# Altium project kmetria.PrjPcb
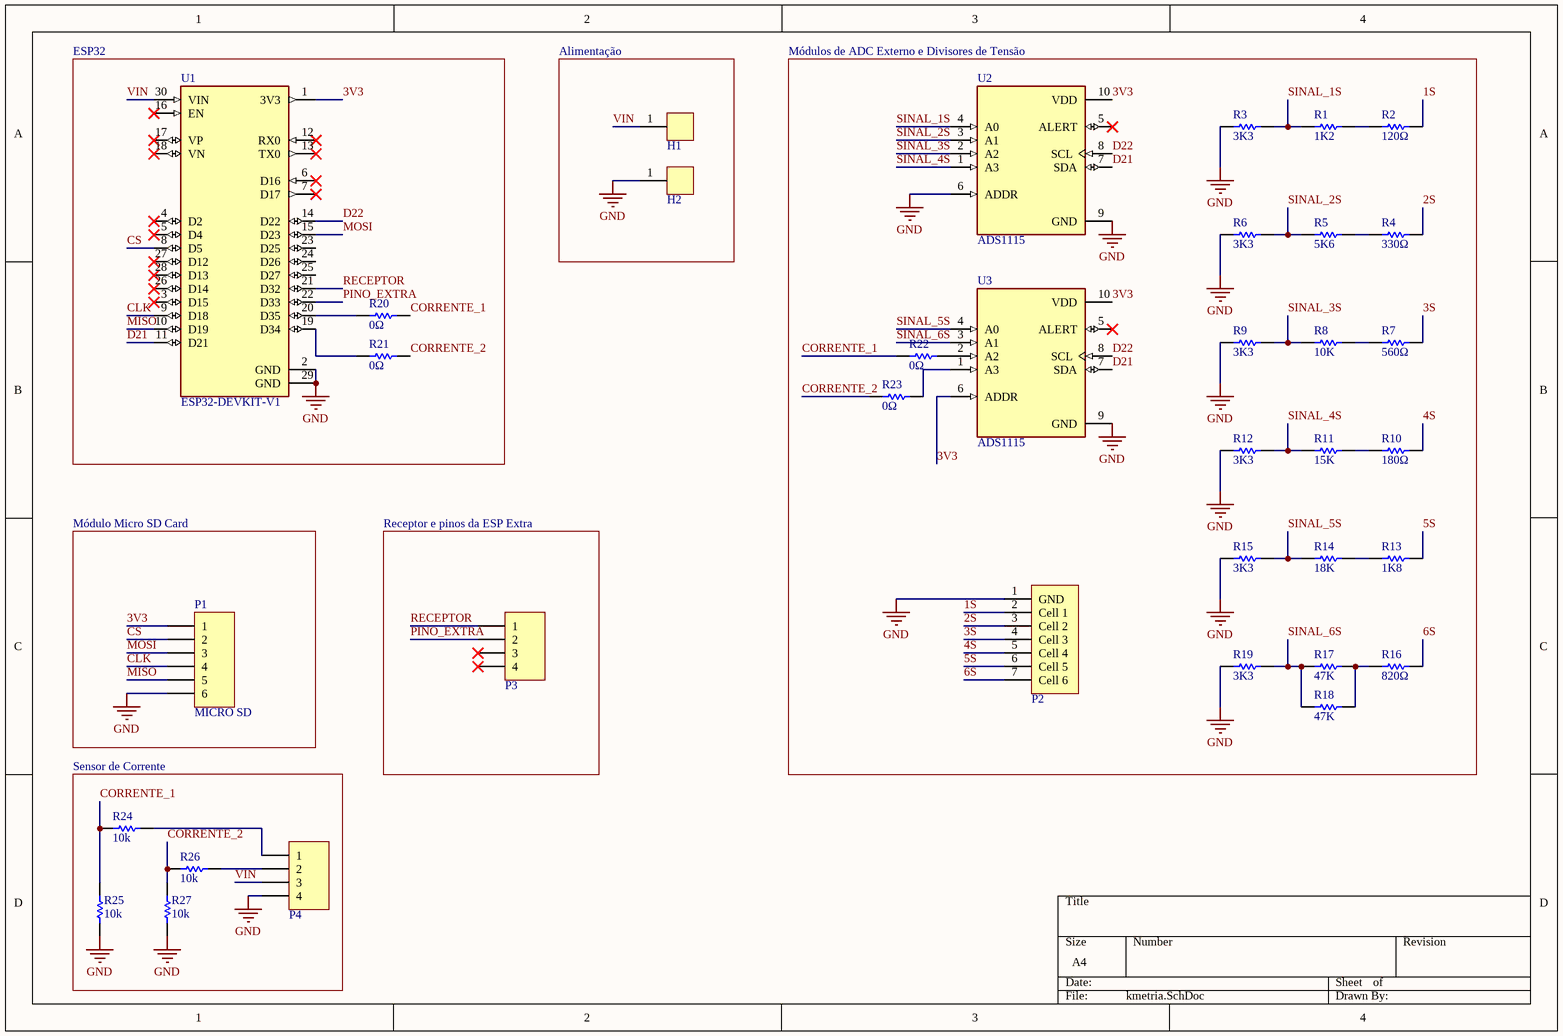
[diagram p0: kmetria.SchDoc]
1 sheet, 36 parts. Net scope: global (net labels, ports and power ports of the same name join across sheets).
Board file: kmetria.PcbDoc

## Sheet kmetria.SchDoc
size A4; SheetNumber: 1; SheetTotal: 1

### Parts
H1  Hole  [Hole 1x1]  (value not drawn)
H2  Hole  [Hole 1x1]  (value not drawn)
P1  MICRO SD  [HDR1X6]
P2  Header Male 1x7  [HDR MALE 1x7]  (value not drawn)
P3  Header 1x4  [HDR MALE 1x4]  (value not drawn)
P4  Header 1x4  [HDR MALE 1x4]  (value not drawn)
R1  1K2  [RESISTOR 0805]
R2  120Ω  [RESISTOR 0805]
R3  3K3  [RESISTOR 0805]
R4  330Ω  [RESISTOR 0805]
R5  5K6  [RESISTOR 0805]
R6  3K3  [RESISTOR 0805]
R7  560Ω  [RESISTOR 0805]
R8  10K  [RESISTOR 0805]
R9  3K3  [RESISTOR 0805]
R10  180Ω  [RESISTOR 0805]
R11  15K  [RESISTOR 0805]
R12  3K3  [RESISTOR 0805]
R13  1K8  [RESISTOR 0805]
R14  value 18K  [RESISTOR 0805]  (hidden comment: Resistor 1k +/-1% 1206 250 mW)
R15  3K3  [RESISTOR 0805]
R16  820Ω  [RESISTOR 0805]
R17  47K  [RESISTOR 0805]
R18  47K  [RESISTOR 0805]
R19  3K3  [RESISTOR 0805]
R20  0Ω  [RESISTOR 0805]
R21  0Ω  [RESISTOR 0805]
R22  0Ω  [RESISTOR 0805]
R23  0Ω  [RESISTOR 0805]
R24  10k  [RESISTOR 0805]
R25  10k  [RESISTOR 0805]
R26  10k  [RESISTOR 0805]
R27  10k  [RESISTOR 0805]
U1  ESP32-DEVKIT-V1  [MODULE_ESP32_DEVKIT_V1]  (value not drawn)
U2  ADS1115  [MODULE_ZC261500]
U3  ADS1115  [MODULE_ZC261500]

### Blocks framed on the sheet
ESP32: R20 R21 U1
Alimentação: H1 H2
Módulos de ADC Externo e Divisores de Tensão: P2 R1-R19 R22 R23 U2 U3
Módulo Micro SD Card: P1
Receptor e pinos da ESP Extra: P3
Sensor de Corrente: P4 R24-R27

### Nets
GND: H2.1 P1.6 P2.1(GND) P4.4 R3.1 R6.1 R9.1 R12.1 R15.1 R19.1 R25.1 R27.1 U1.2(GND) U1.29(GND) U2.6(ADDR) U2.9(GND) U3.9(GND)
1S: P2.2(Cell_1) R2.2
2S: P2.3(Cell_2) R4.2
3S: P2.4(Cell_3) R7.2
3V3: P1.1 U1.1(3V3) U2.10(VDD) U3.6(ADDR) U3.10(VDD)
4S: P2.5(Cell_4) R10.2
5S: P2.6(Cell_5) R13.2
6S: P2.7(Cell_6) R16.2
CLK: P1.4 U1.9(D18)
CORRENTE_1: R20.2 R22.1 R24.1 R25.2
CORRENTE_2: R21.2 R23.1 R26.1 R27.2
CS: P1.2 U1.8(D5)
D21: U1.11(D21) U2.7(SDA) U3.7(SDA)
D22: U1.14(D22) U2.8(SCL) U3.8(SCL)
MISO: P1.5 U1.10(D19)
MOSI: P1.3 U1.15(D23)
PINO_EXTRA: P3.2 U1.22(D33)
RECEPTOR: P3.1 U1.21(D32)
SINAL_1S: R1.1 R3.2 U2.4(A0)
SINAL_2S: R5.1 R6.2 U2.3(A1)
SINAL_3S: R8.1 R9.2 U2.2(A2)
SINAL_4S: R11.1 R12.2 U2.1(A3)
SINAL_5S: R14.1 R15.2 U3.4(A0)
SINAL_6S: R17.1 R18.1 R19.2 U3.3(A1)
VIN: H1.1 P4.3 U1.30(VIN)
NetP4_1: P4.1 R24.2
NetP4_2: P4.2 R26.2
NetR1_2: R1.2 R2.1
NetR4_1: R4.1 R5.2
NetR7_1: R7.1 R8.2
NetR10_1: R10.1 R11.2
NetR13_1: R13.1 R14.2
NetR16_1: R16.1 R17.2 R18.2
NetR20_1: R20.1 U1.20(D35)
NetR21_1: R21.1 U1.19(D34)
NetR22_2: R22.2 U3.2(A2)
NetR23_2: R23.2 U3.1(A3)

Not connected (* = marked no-connect by the designer): P3 3* 4*; U1 3(D15)* 4(D2)* 5(D4)* 6(D16)* 7(D17)* 12(RX0)* 13(TX0)* 16(EN)* 17(VP)* 18(VN)* 23(D25) 24(D26) 25(D27) 26(D14)* 27(D12)* 28(D13)*; U2 5(ALERT)*; U3 5(ALERT)*

### Library data of the parts
H1 H2 = Hole: General Purpose hole
P1 = Header Male 1x6: Headers & Wire Housings 36Pin 2mm Spacing Single Row Hdrs, 5pc; Manufacturer: Molex, LLC; Manufacturer Part Number: 0022284360; Connector Type: Header, Unshrouded, Breakaway; Number of Positions: 36; Number of Positions Loaded: All; Pitch: 0.100" (2.54mm); Supplier 1: Digi-Key; RoHS: RoHS Compliant; Category: Connectors, Interconnects; Stock 1: 9595; Pricing 1: 1=0.98, 10=0.858, 25=0.808, 50=0.7742, 100=0.7405, 250=0.6732, 500=0.60588 (USD); Packaging: Bulk; Contact Type: Male Pin; Number of Rows: 1; Row Spacing: -; Contact Mating Length: 0.240" (6.10mm); Mounting Type: Through Hole; Termination: Solder; Fastening Type: -; Features: -; Contact Finish: Tin; Contact Finish Thickness: 100µin (2.54µm); Color: Black; ComponentLink1URL: http://www.molex.com/pdm_docs/sd/022284360_sd.pdf; ComponentLink1Description: http://www.molex.com/pdm_docs/sd/022284360_sd.pdf; Supplier Part Number 1: WM50014-36-ND
P2 = Header Male 1x7: Headers & Wire Housings 40Pin 2mm Spacing Single Row Hdrs, 5pc; Manufacturer: Cromax; Manufacturer Part Number: IMP10327; Mounting Angle: Vertical; Number of Positions: 40 Position; Supplier 1: Mult Comercial; RoHS: RoHS Compliant; Category: Headers & Wire Housings; Stock 1: 14; Pricing 1: 1=1.00, 5=0.20 (BRL); Accessory Type: -; Contact Plating: Gold; Contact Type: -; Number of Rows: 1 Row; Product: Headers; Termination Style: Through Hole; Type: Breakaway; Brand: Cromax; Mounting Style: Straight Pin; Pitch: 2 mm; Row Spacing: -; Contact Gender: Pin (Male); Product Category: Accessories; RoHS - Mouser: Y; Minimum Order Quantity: 1; Reeling: False; ComponentLink1URL: http://loja.multcomercial.com.br/barra-de-pinos-simples-1x40-macho-bmo40-1e.html; ComponentLink1Description: http://loja.multcomercial.com.br/barra-de-pinos-simples-1x40-macho-bmo40-1e.html; Supplier Part Number 1: Barra de Pinos Simples 1x40 Macho BMO40-1E
P3 P4 = Header 1x4: Headers & Wire Housings 40Pin 2mm Spacing Single Row Hdrs, 5pc; Manufacturer: Cromax; Manufacturer Part Number: IMP10327; Mounting Angle: Vertical; Number of Positions: 40 Position; Supplier 1: Mult Comercial; RoHS: RoHS Compliant; Category: Headers & Wire Housings; Stock 1: 14; Pricing 1: 1=1.00, 5=0.20 (BRL); Accessory Type: -; Contact Plating: Gold; Contact Type: -; Number of Rows: 1 Row; Product: Headers; Termination Style: Through Hole; Type: Breakaway; Brand: Cromax; Mounting Style: Straight Pin; Pitch: 2 mm; Row Spacing: -; Contact Gender: Pin (Male); Product Category: Accessories; RoHS - Mouser: Y; Minimum Order Quantity: 1; Reeling: False; ComponentLink1URL: http://loja.multcomercial.com.br/barra-de-pinos-simples-1x40-macho-bmo40-1e.html; ComponentLink1Description: http://loja.multcomercial.com.br/barra-de-pinos-simples-1x40-macho-bmo40-1e.html; Supplier Part Number 1: Barra de Pinos Simples 1x40 Macho BMO40-1E
R1 R2 R5 R7 R11 R13 R16 = RES SMD 5% 0805: Resistance (Ohms): 10k; Category: Resistors; Tolerance: ±5%; Supplier Device Package: 0805
R3 R4 R6 R9 R10 R12 R15 R17-R23 = RES 5% 0603: Thick Film Resistors - SMD 0603 5%; Manufacturer: Yageo; Manufacturer Part Number: RC0603JR-071R8L; Power Rating: 100 mW; Resistance: 1.8 Ohms; Temperature Coefficient: 200 PPM / C; Voltage Rating: 75 V; Supplier 1: Mouser; RoHS: RoHS Compliant; Category: Thick Film Resistors - SMD; Stock 1: 37637; Pricing 1: 1=0.100, 10=0.008, 100=0.003, 1000=0.002, 5000=0.002, 50000=0.001 (USD); Height: 0.45 mm; Length: 1.6 mm; Operating Temperature Range: - 55 C to + 155 C; Package / Case: 0603 (1608 metric); Packaging: Reel; Product: Thick Film Resistors General Purpose; Series: RC; Termination Style: SMD/SMT; Tolerance: 5 %; Type: General Purpose Chip Resistor Surface Mount; Width: 0.8 mm; Brand: Yageo; Case Code - in: 0603; Case Code - mm: 1608; Standard Pack Qty: 5000; RoHS - Mouser: Y; Minimum Order Quantity: 1; Reeling: True; ComponentLink1URL: http://www.mouser.com/ds/2/447/RC0603-272842.pdf; ComponentLink1Description: http://www.mouser.com/ds/2/447/RC0603-272842.pdf; Supplier Part Number 1: 603-RC0603JR-071R8L
R8 R24-R27 = RES SMD 5% 0805: Category: Resistors; Resistance (Ohms): 10k; Tolerance: ±5%; Supplier Device Package: 0805
R14 = RES 1206: Chip Resistor, 1 KOhm, +/- 1%, 0.25 W, -55 to 155 degC, 1206 (3216 Metric)
U1 = ESP32-DEVKIT-V1: Dual core, Wi-Fi: 2.4 GHz up to 150 Mbits/s,BLE (Bluetooth Low Energy) and legacy Bluetooth, 32 bits, Up to 240 MHz; MF: Do it; SnapEDA_Link: https://www.snapeda.com/parts/ESP32-DEVKIT-V1/Do+it/view-part/?ref=snap; Package: None; Value: *; MP: ESP32-DEVKIT-V1; Check_prices: https://www.snapeda.com/parts/ESP32-DEVKIT-V1/Do+it/view-part/?ref=eda
U2 U3 = ZC261500: ADS1115 Module ADC 4 channel with Pro Gain Amplifier for Arduino RPi; MF: YKS; Value: *; SnapEDA_Link: https://www.snapeda.com/parts/ZC261500/YKS/view-part/621058/?ref=snap; MP: ZC261500; Availability: Unavailable; Price: None; Package: None